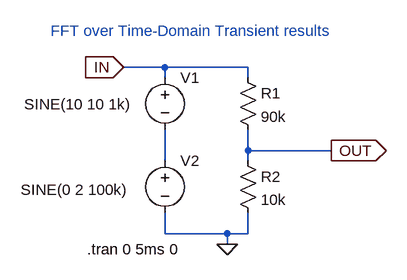
[diagram p0: schematic FFT_Example.asc]
FFT_Example.asc, the LTspice schematic file:
Version 4
SHEET 1 916 680
WIRE 400 192 336 192
WIRE 528 192 400 192
WIRE 400 208 400 192
WIRE 528 208 528 192
WIRE 528 320 528 288
WIRE 656 320 528 320
WIRE 400 336 400 288
WIRE 528 336 528 320
WIRE 400 448 400 416
WIRE 496 448 400 448
WIRE 528 448 528 416
WIRE 528 448 496 448
WIRE 496 464 496 448
FLAG 496 464 0
FLAG 656 320 OUT
IOPIN 656 320 Out
FLAG 336 192 IN
IOPIN 336 192 In
SYMBOL voltage 400 192 R0
WINDOW 123 0 0 Left 2
WINDOW 39 0 0 Left 2
WINDOW 3 -217 57 Left 2
SYMATTR Value SINE(10 10 1k)
SYMATTR InstName V1
SYMBOL res 512 192 R0
SYMATTR InstName R1
SYMATTR Value 90k
SYMBOL res 512 320 R0
SYMATTR InstName R2
SYMATTR Value 10k
SYMBOL voltage 400 320 R0
WINDOW 123 0 0 Left 2
WINDOW 39 0 0 Left 2
WINDOW 3 -222 60 Left 2
SYMATTR Value SINE(0 2 100k)
SYMATTR InstName V2
TEXT 280 472 Left 2 !.tran 0 5ms 0
TEXT 224 136 Left 2 ;FFT over Time-Domain Transient results

The netlist it stands for:
* FFT_Example.asc
V1 IN N001 SINE(10 10 1k)
R1 IN OUT 90k
R2 OUT 0 10k
V2 N001 0 SINE(0 2 100k)
.tran 0 5ms 0
* FFT over Time-Domain Transient results
.backanno
.end

* Results of the author's LTspice run, read from the files saved beside the schematic
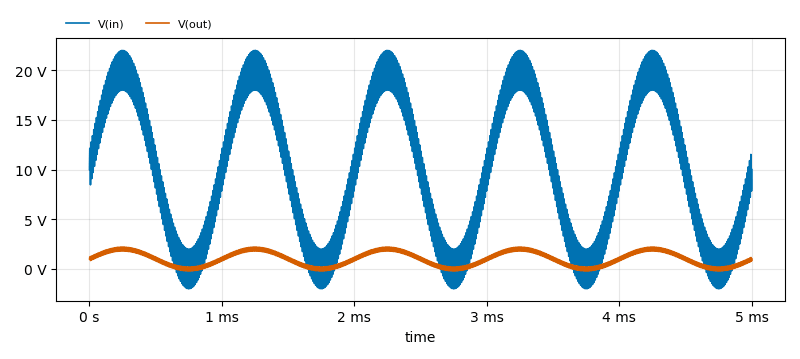
[diagram p1: Transient Analysis of FFT_Example.asc, plotted from the saved traces]
* Transient Analysis, 1 run:
*   V(in): min -1.998 V, max 22 V, average 10 V, rms 12.33 V, last 10 V
*   V(out): min -199.2 mV, max 2.199 V, average 1 V, rms 1.233 V, last 1 V